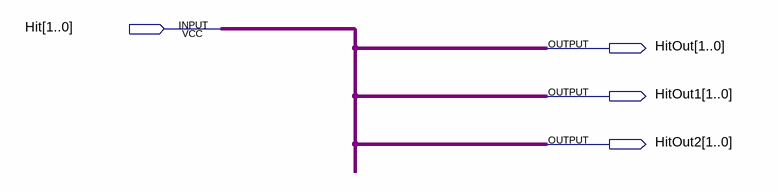
[diagram p0: schematic sheet]
// Quartus schematic HitSeparator.bdf as structural Verilog: 0 symbols, 4 pins
module HitSeparator (
  input  [1:0] Hit,
  output [1:0] HitOut,
  output [1:0] HitOut1,
  output [1:0] HitOut2
);


  assign HitOut = Hit;
  assign HitOut1 = Hit;
  assign HitOut2 = Hit;
endmodule
